# EasyEDA Pro project split-keyboard.epro, board PCB8_1
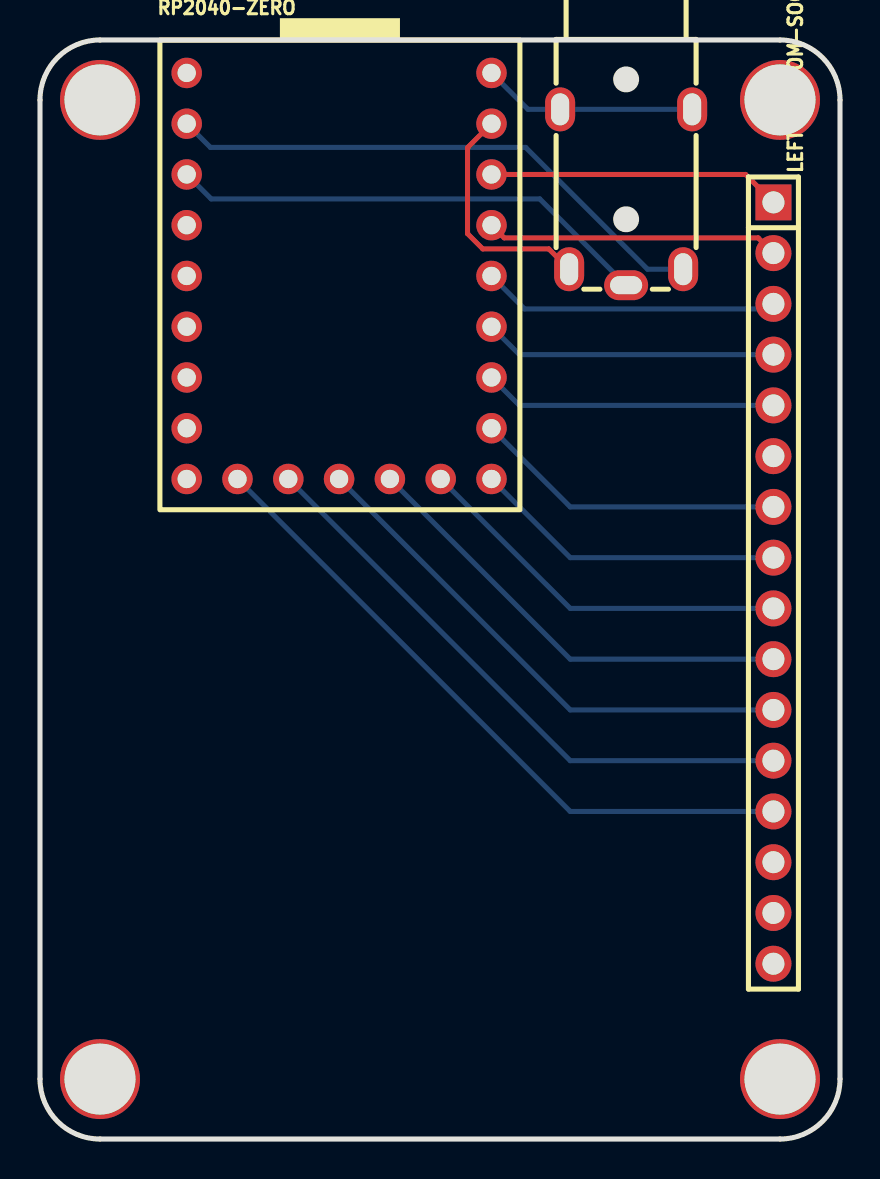
[diagram p11: board, top side]
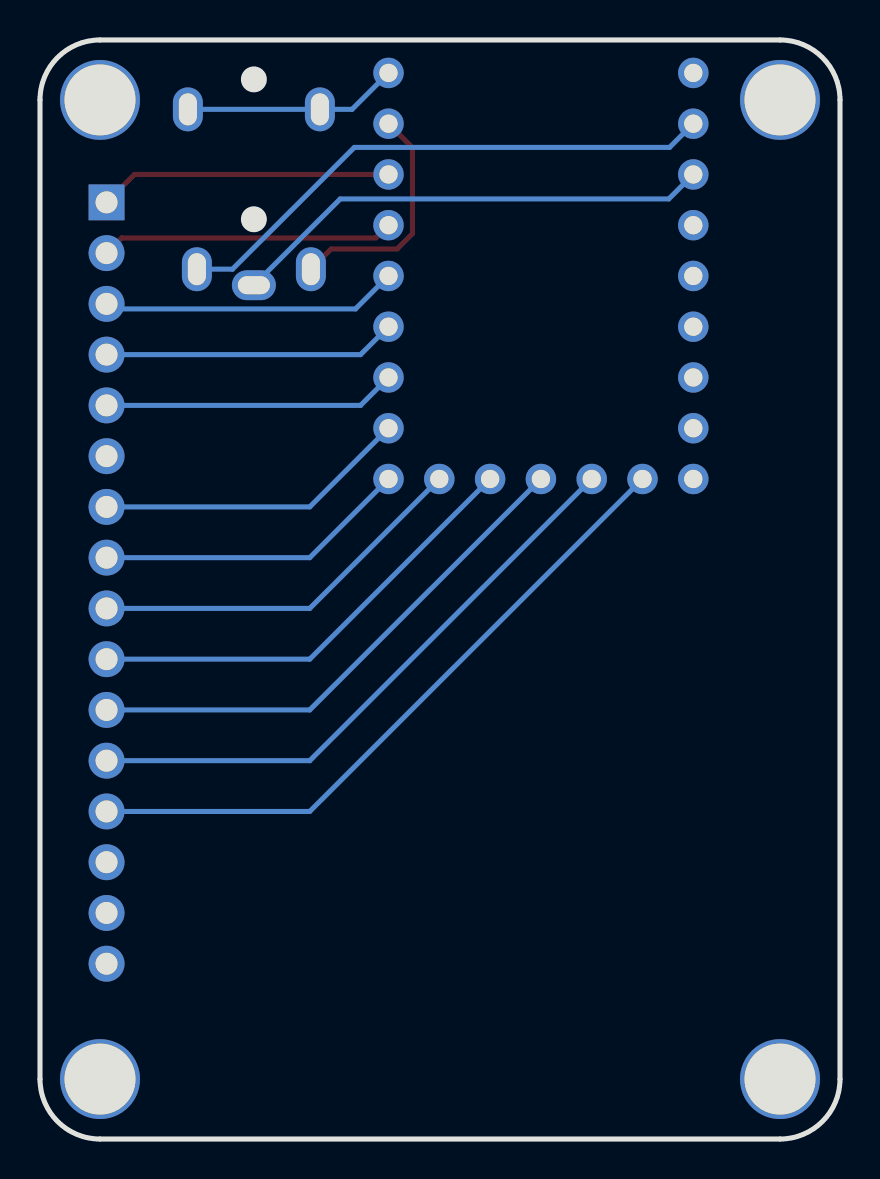
[diagram p12: board, bottom side, seen from below]

Outline 40 x 55 mm; copper layers: Top Layer, Bottom Layer. Coordinates in mm from the lower left corner of the outline.
Outline path: 0,52 0,3 arc(0.88,0.88) 3,0 37,0 arc(39.12,0.88) 40,3 40,52 arc(39.12,54.12) 37,55 3,55 arc(0.88,54.12) 0,52
Stack: Top Layer 0.035mm / Dielectric1 1.51mm FR4 er 4.5 / Bottom Layer 0.035mm

## Design rules (mm)
template: JLCPCB Capability(Two Layers Board)
spacing copperThickness1oz (default): track to track 0.102, other pairs 0.152 to 0.3
spacing copperThickness2oz: track to track 0.203, other pairs 0.152 to 0.3
track width copperThickness1oz (default): min 0.127, default 0.254, max 2.54
track width copperThickness2oz: min 0.203, default 0.254, max 2.54
differential pair differentialPair (default): width min 0.127, default 0.254, max 2.54; gap min 0.152, default 0.152
via viaSize (default): diameter min 0.5, default 0.61, max 10; hole min 0.3, default 0.305, max 6.3

## Placement (name value [footprint] x y rotation side)
LEFT-AUX  PJ-322A-G  [AUDIO-TH_PJ-322A-Y]  29.31 47.13 270 top
LEFT-BOTTOM-SOCKET  DS1021-1x16SF11-B  [HDR-TH_16P-P2.54-V-M]  36.67 27.82 270 top
NOREF  -  [Pad_e10]  3 3 0 top
NOREF#2  -  [Pad_e9]  37 52 0 top
NOREF#3  -  [Pad_e8]  3 52 0 top
NOREF#4  -  [Pad_e11]  37 3 0 top
RP2040-ZERO  -  [RP2040-Zero]  4.8 30.49 0 top

## Footprints (pads in the part's own frame, mm; a bottom-side part is the same pattern mirrored in y, then rotated)
AUDIO-TH_PJ-322A-Y
  oval 1.5x2.2 hole 0.9x1.6: 1(4.4,0)
  oval 2.2x1.5 hole 1.6x0.9: 2(3.6,2.85) 3(-4.4,3.3) 3(-4.4,-3.3) 4(3.6,-2.85)
HDR-TH_16P-P2.54-V-M
  rect 1.8x1.8 hole 1.1: 1(-19.05,0)
  round 1.8 hole 1.1: 2(-16.51,0) 3(-13.97,0) 4(-11.43,0) 5(-8.89,0) 6(-6.35,0) 7(-3.81,0) 8(-1.27,0) 9(1.27,0) 10(3.81,0) 11(6.35,0) 12(8.89,0) 13(11.43,0) 14(13.97,0) 15(16.51,0) 16(19.05,0)
Pad_e8
  round 4 hole 3.55: 1(0,0)
Pad_e9
  round 4 hole 3.55: 2(0,0)
Pad_e10
  round 4 hole 3.55: 3(0,0)
Pad_e11
  round 4 hole 3.55: 4(0,0)
RP2040-Zero
  round 1.524 hole 0.914: 1(17.78,22.86) 2(17.78,20.32) 3(17.78,17.78) 4(17.78,15.24) 5(17.78,12.7) 6(17.78,10.16) 7(17.78,7.62) 8(17.78,5.08) 9(17.78,2.54) 10(15.24,2.54) 11(12.7,2.54) 12(10.16,2.54) 13(7.62,2.54) 14(5.08,2.54) 15(2.54,2.54) 16(2.54,5.08) 17(2.54,7.62) 18(2.54,10.16) 19(2.54,12.7) 20(2.54,15.24) 21(2.54,17.78) 22(2.54,20.32) 23(2.54,22.86)

## Nets
As in the schematic.

Pads without a net: LEFT-BOTTOM-SOCKET 6 14 15 16; NOREF 3; NOREF#2 2; NOREF#3 1; NOREF#4 4; RP2040-ZERO 15 16 17 18 19 20 23

## Routing (per net, layer and track width the routed paths; a pad name or vN(x,y) marks a point on that pad's centre or on a via; arc(x,y) is an arc through that point)
3V3: length 24.3
  Bottom Layer w0.254: RP2040-ZERO.21 8.56,47.05 24.99,47.05 29.31,42.73
GND: length 27.8
  Bottom Layer w0.254: RP2040-ZERO.22 8.52,49.62 24.28,49.62 30.38,43.53 LEFT-AUX.2
COL0: length 15.7
  Bottom Layer w0.254: RP2040-ZERO.8 26.51,31.63 36.67,31.63
COL1: length 15.7
  Bottom Layer w0.254: LEFT-BOTTOM-SOCKET.8 26.51,29.09 RP2040-ZERO.9
COL2: length 19.3
  Bottom Layer w0.254: RP2040-ZERO.10 26.51,26.55 36.67,26.55
COL3: length 22.9
  Bottom Layer w0.254: LEFT-BOTTOM-SOCKET.10 26.51,24.01 RP2040-ZERO.11
COL4: length 26.5
  Bottom Layer w0.254: RP2040-ZERO.12 26.51,21.47 36.67,21.47
COL5: length 30.1
  Bottom Layer w0.254: RP2040-ZERO.13 26.51,18.93 LEFT-BOTTOM-SOCKET.12
COL6: length 33.7
  Bottom Layer w0.254: RP2040-ZERO.14 26.51,16.39 LEFT-BOTTOM-SOCKET.13
ROW0: length 14.7
  Top Layer w0.254: LEFT-BOTTOM-SOCKET.1 35.28,48.27 RP2040-ZERO.3
ROW1: length 14.7
  Top Layer w0.254: 36.67,44.33 35.91,45.1 23.21,45.1 RP2040-ZERO.4
ROW2: length 14.9
  Bottom Layer w0.254: RP2040-ZERO.5 24.23,41.54 36.42,41.54 LEFT-BOTTOM-SOCKET.3
ROW3: length 14.7
  Bottom Layer w0.254: RP2040-ZERO.6 23.97,39.25 36.67,39.25
ROW4: length 14.7
  Bottom Layer w0.254: LEFT-BOTTOM-SOCKET.5 23.97,36.71 RP2040-ZERO.7
RX0: length 11.8
  Top Layer w0.254: LEFT-AUX.4 25.44,44.54 22.14,44.54 21.38,45.31 21.38,49.61 RP2040-ZERO.2
TX0: length 10.8
  Bottom Layer w0.254: RP2040-ZERO.1 24.4,51.53 LEFT-AUX.3 LEFT-AUX.3
